# EAGLE design SuperPET OS9 MMU v2.9 (EAGLE 7.7.0)
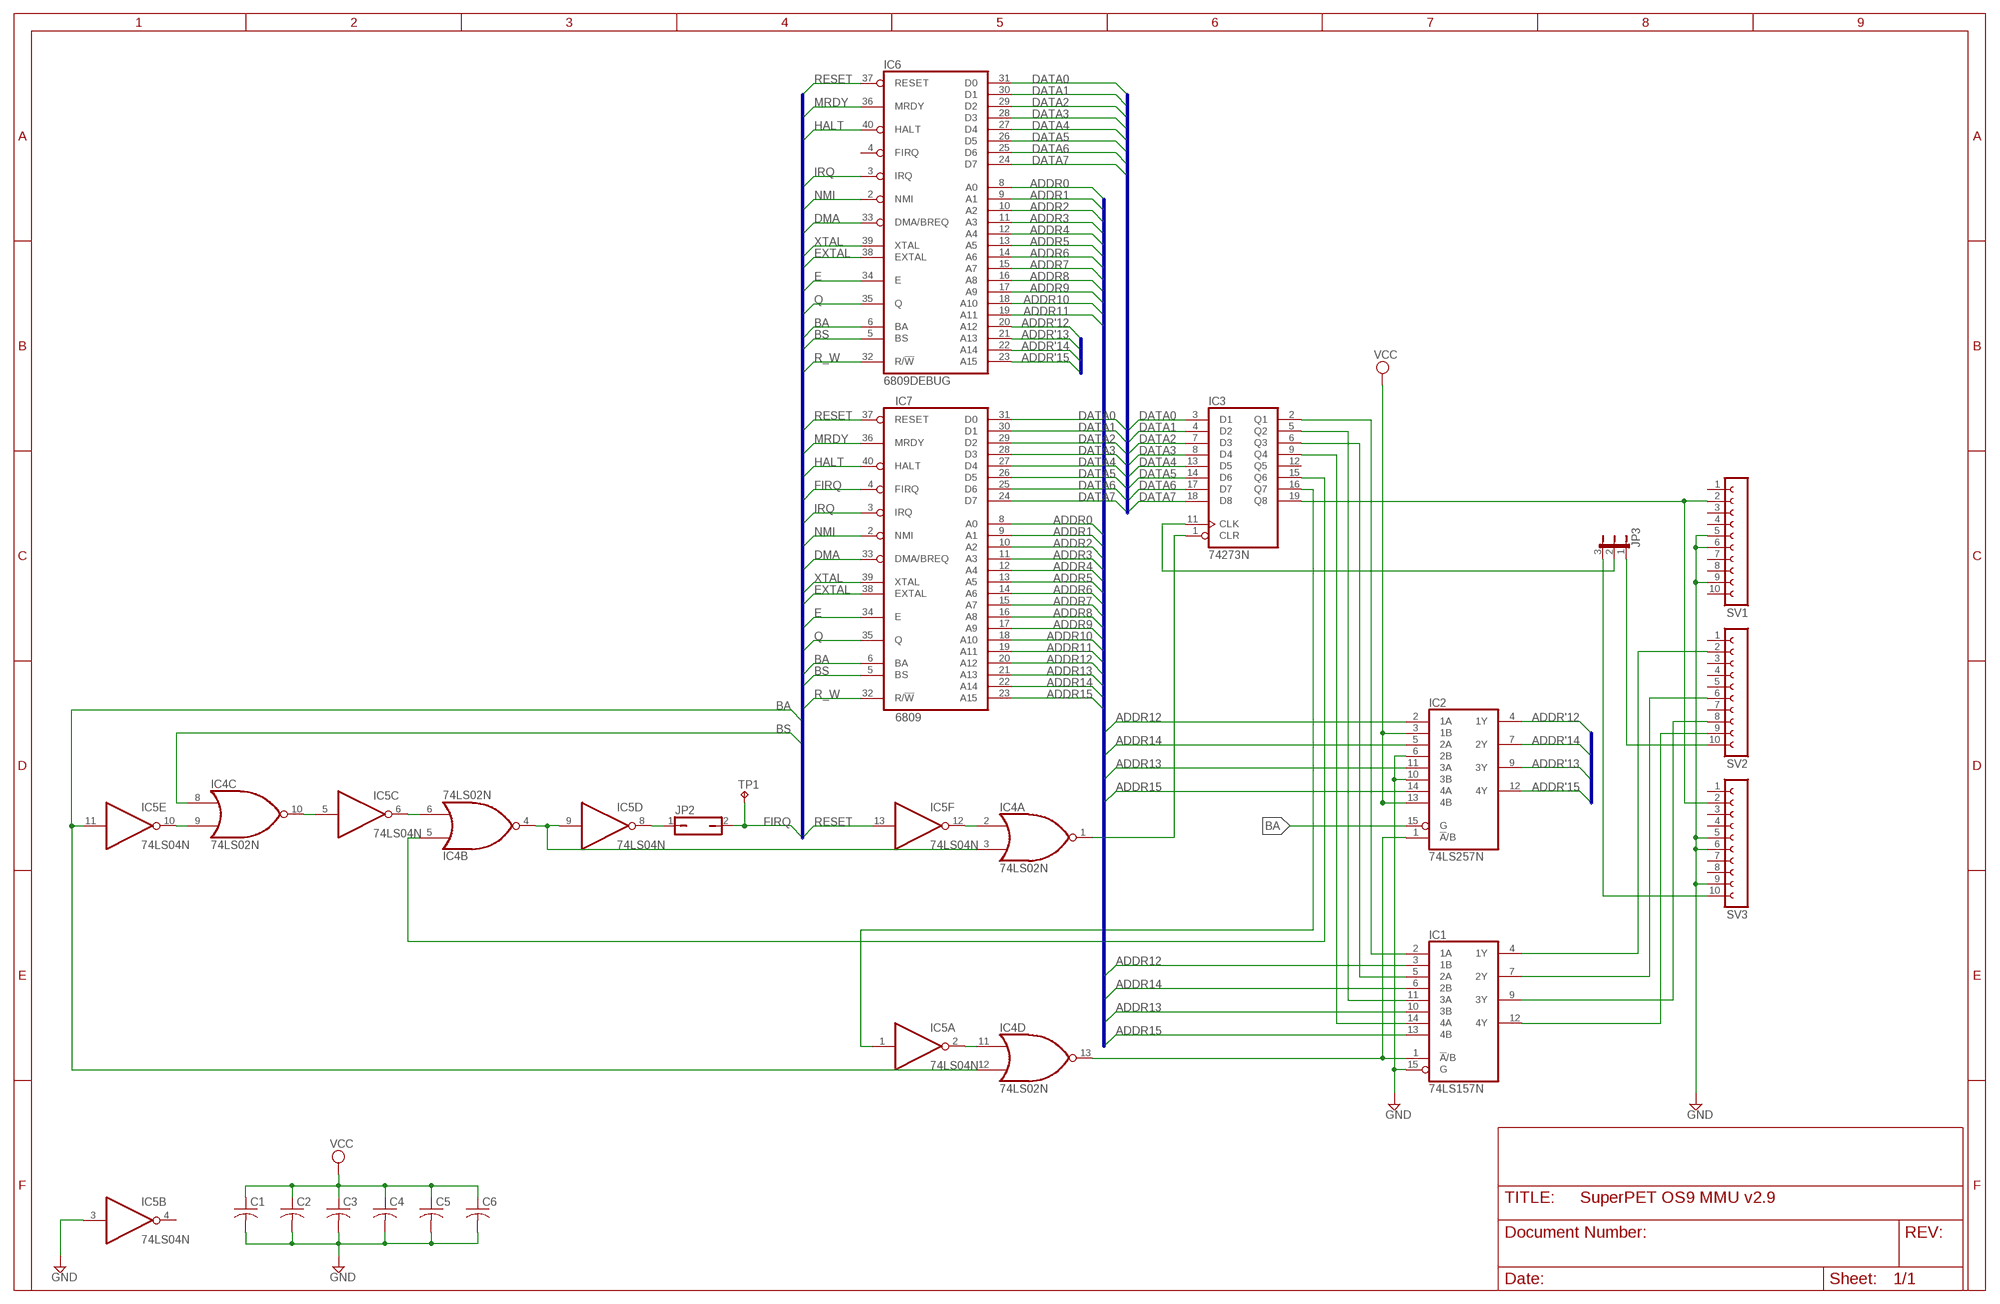
[diagram p0: schematic, sheet 1]

## Parts
C1  C-US025-025X050  [C025-025X050]
C2  C-US025-025X050  [C025-025X050]
C3  C-US025-025X050  [C025-025X050]
C4  C-US025-025X050  [C025-025X050]
C5  C-US025-025X050  [C025-025X050]
C6  C-US025-025X050  [C025-025X050]
IC1  74LS157N  [DIL16]
IC2  74LS257N  [DIL16]
IC3  74273N  [DIL20]
IC4  74LS02N  [DIL14]
IC5  74LS04N  [DIL14]
IC6  6809DEBUG  [DIL40]
IC7  6809  [DIL40]
JP2  JP1Q  [JP1]
JP3  JP2E  [JP2]
SV1  FE10-1  [FE10]
SV2  FE10-1  [FE10]
SV3  FE10-1  [FE10]
TP1  TPPAD1-17  [P1-17]

## Nets
ADDR0: IC6.8(A0) IC7.8(A0)
ADDR1: IC6.9(A1) IC7.9(A1)
ADDR2: IC6.10(A2) IC7.10(A2)
ADDR3: IC6.11(A3) IC7.11(A3)
ADDR4: IC6.12(A4) IC7.12(A4)
ADDR5: IC6.13(A5) IC7.13(A5)
ADDR6: IC6.14(A6) IC7.14(A6)
ADDR7: IC6.15(A7) IC7.15(A7)
ADDR8: IC6.16(A8) IC7.16(A8)
ADDR9: IC6.17(A9) IC7.17(A9)
ADDR10: IC6.18(A10) IC7.18(A10)
ADDR11: IC6.19(A11) IC7.19(A11)
ADDR12: IC1.3(1B) IC2.2(1A) IC7.20(A12)
ADDR13: IC1.10(3B) IC2.11(3A) IC7.21(A13)
ADDR14: IC1.6(2B) IC2.5(2A) IC7.22(A14)
ADDR15: IC1.13(4B) IC2.14(4A) IC7.23(A15)
ADDR'12: IC2.4(1Y) IC6.20(A12)
ADDR'13: IC2.9(3Y) IC6.21(A13)
ADDR'14: IC2.7(2Y) IC6.22(A14)
ADDR'15: IC2.12(4Y) IC6.23(A15)
BA: IC2.15(G) IC4.12(D:I1) IC5.11(E:I) IC6.6(BA) IC7.6(BA)
BS: IC4.8(C:I0) IC6.5(BS) IC7.5(BS)
DATA0: IC3.3(D1) IC6.31(D0) IC7.31(D0)
DATA1: IC3.4(D2) IC6.30(D1) IC7.30(D1)
DATA2: IC3.7(D3) IC6.29(D2) IC7.29(D2)
DATA3: IC3.8(D4) IC6.28(D3) IC7.28(D3)
DATA4: IC3.13(D5) IC6.27(D4) IC7.27(D4)
DATA5: IC3.14(D6) IC6.26(D5) IC7.26(D5)
DATA6: IC3.17(D7) IC6.25(D6) IC7.25(D6)
DATA7: IC3.18(D8) IC6.24(D7) IC7.24(D7)
DMA: IC6.33(DMA/BREQ) IC7.33(DMA/BREQ)
E: IC6.34(E) IC7.34(E)
EXTAL: IC6.38(EXTAL) IC7.38(EXTAL)
FIRQ: IC7.4(FIRQ) JP2.2 TP1.1(TP)
GND: C1.2 C2.2 C3.2 C4.2 C5.2 C6.2 IC1.15(G) IC2.6(2B) IC2.10(3B) IC5.3(B:I) SV1.5 SV1.6 SV1.9 SV3.5 SV3.6 SV3.9
HALT: IC6.40(HALT) IC7.40(HALT)
IRQ: IC6.3(IRQ) IC7.3(IRQ)
MRDY: IC6.36(MRDY) IC7.36(MRDY)
N$5: IC1.1(!A!/B) IC2.1(!A!/B) IC4.13(D:O)
N$6: IC3.1(CLR) IC4.1(A:O)
N$7: IC4.2(A:I0) IC5.12(F:O)
N$8: IC5.8(D:O) JP2.1
N$9: IC4.3(A:I1) IC4.4(B:O) IC5.9(D:I)
N$10: IC3.15(Q6) IC4.5(B:I0)
N$11: IC4.6(B:I1) IC5.6(C:O)
N$12: IC4.10(C:O) IC5.5(C:I)
N$13: IC4.9(C:I1) IC5.10(E:O)
N$14: IC4.11(D:I0) IC5.2(A:O)
N$15: IC3.16(Q7) IC5.1(A:I)
N$16: IC1.2(1A) IC3.2(Q1)
N$17: IC1.14(4A) IC3.9(Q4)
N$18: IC1.11(3A) IC3.5(Q2)
N$19: IC1.7(2Y) SV2.6
N$20: IC3.19(Q8) SV1.2 SV3.2
N$21: IC1.12(4Y) SV2.9
N$22: JP3.1 SV2.10
N$23: IC3.11(CLK) JP3.2
N$24: JP3.3 SV3.10
N$25: IC1.5(2A) IC3.6(Q3)
N$26: IC1.4(1Y) SV2.2
N$27: IC1.9(3Y) SV2.8
NMI: IC6.2(NMI) IC7.2(NMI)
Q: IC6.35(Q) IC7.35(Q)
R_W: IC6.32(R/!W) IC7.32(R/!W)
RESET: IC5.13(F:I) IC6.37(RESET) IC7.37(RESET)
VCC: C1.1 C2.1 C3.1 C4.1 C5.1 C6.1 IC2.3(1B) IC2.13(4B)
XTAL: IC6.39(XTAL) IC7.39(XTAL)
Unconnected: IC3.12(Q5) IC5.4(B:O) IC6.4(FIRQ) SV1.1 SV1.3 SV1.4 SV1.7 SV1.8 SV1.10 SV2.1 SV2.3 SV2.4 SV2.5 SV2.7 SV3.1 SV3.3 SV3.4 SV3.7 SV3.8

## Buses
RESET,MRDY,HALT,FIRQ,IRQ,NMI,DMA,XTAL,EXTAL,E,Q,BA,BS,R_W
ADDR[0..15]
DATA[0..7]
ADDR'[12..15]

## Power pins joined to a net without a drawn wire
GND: IC1.8(GND) IC2.8(GND) IC3.10(GND) IC4.7(P:GND) IC5.7(P:GND) IC6.1(GND) IC7.1(GND)
VCC: IC1.16(VCC) IC2.16(VCC) IC3.20(VCC) IC4.14(P:VCC) IC5.14(P:VCC) IC6.7(VCC) IC7.7(VCC)

## Library data of the parts
C1-C6 = rcl:C-US: CAPACITOR, American symbol
IC1 = 74xx-us:74*157: Quadruple 2-line to 1-line data SELECTOR/MULTIPLEXER
IC2 = 74xx-us:74*257: Quadruple 2-to 1 line data SELECTOR/MULTIPLEXER
IC3 = 74xx-us:74*273: Octal D type FLIP FLOP, clear
IC4 = 74xx-us:74*02: Quad 2-input NOR gate
IC5 = 74xx-us:74*04: Hex INVERTER
IC6 = 0RB_Motorola:6809DEBUG: 6809 counterpart to enable to replace the CPU with a PCB
IC7 = 0RB_Motorola:6809: 6809 processor
JP2 = jumper:JP1Q: JUMPER
JP3 = jumper:JP2E: JUMPER
SV1-SV3 = con-lsta:FE10-1: FEMALE HEADER
TP1 = testpad:TP: Test pad

## Board
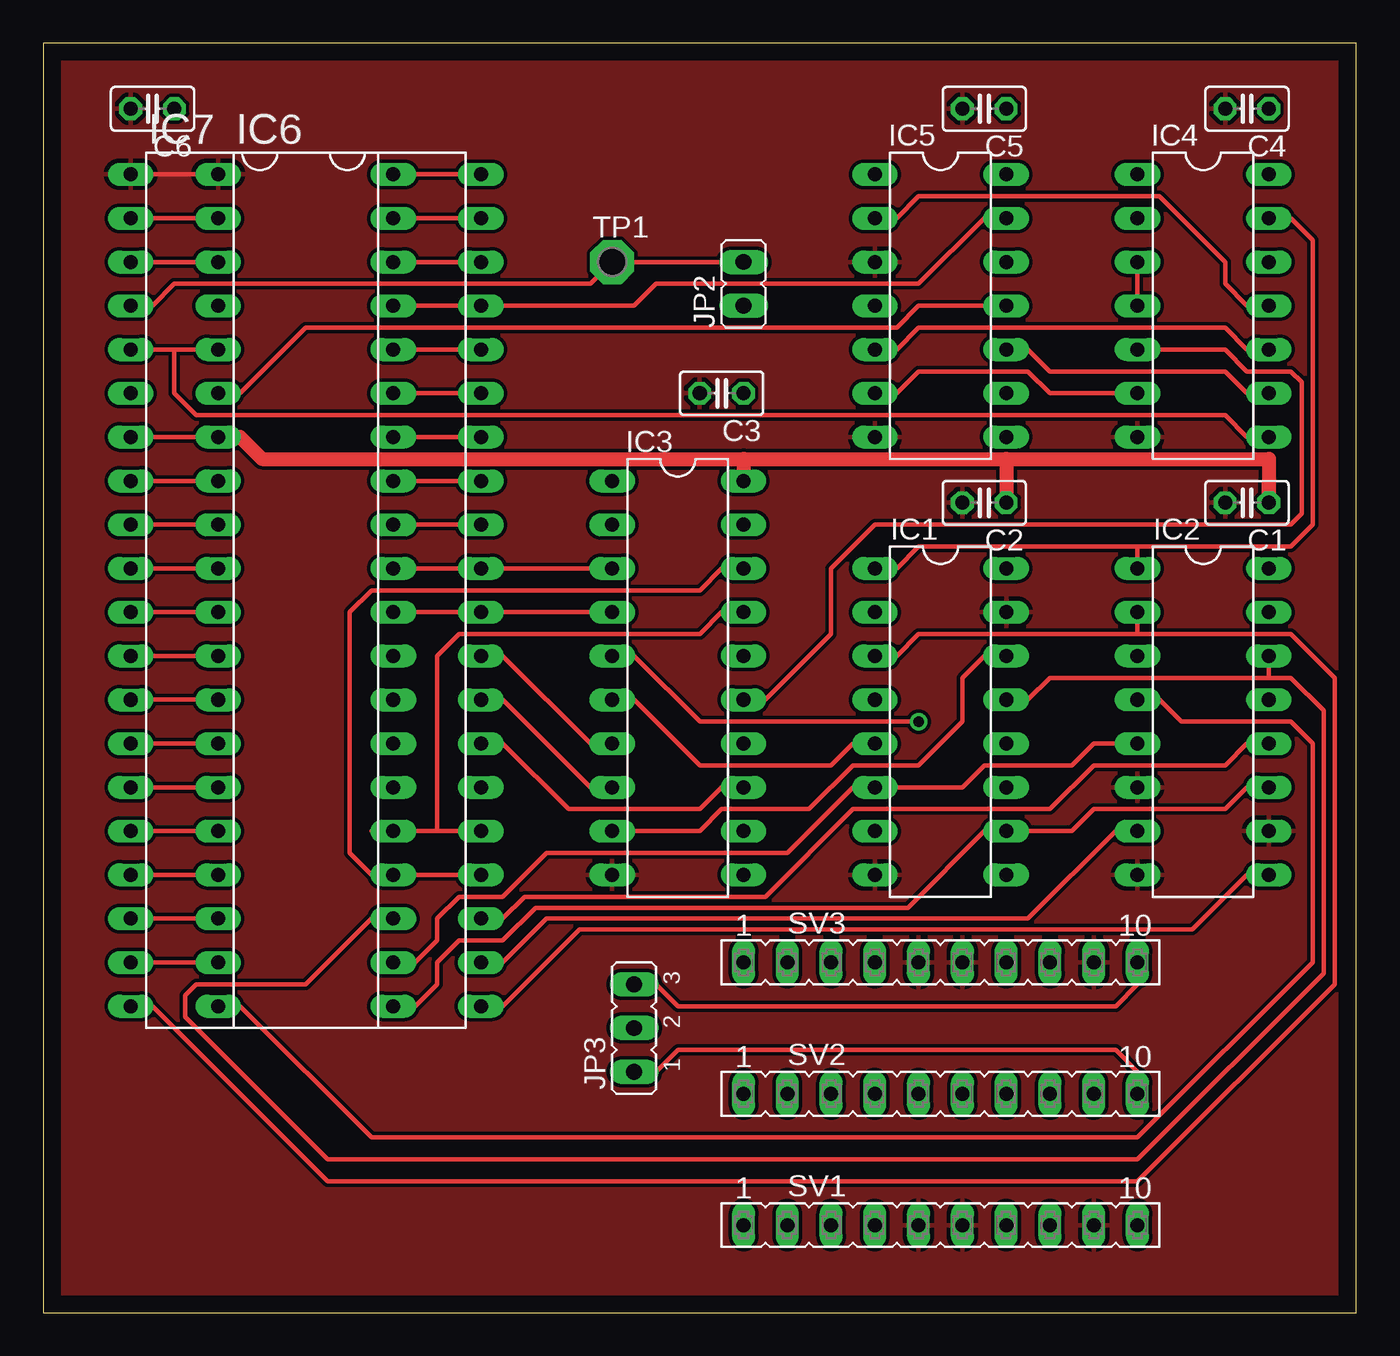
[diagram p1: board, top side]
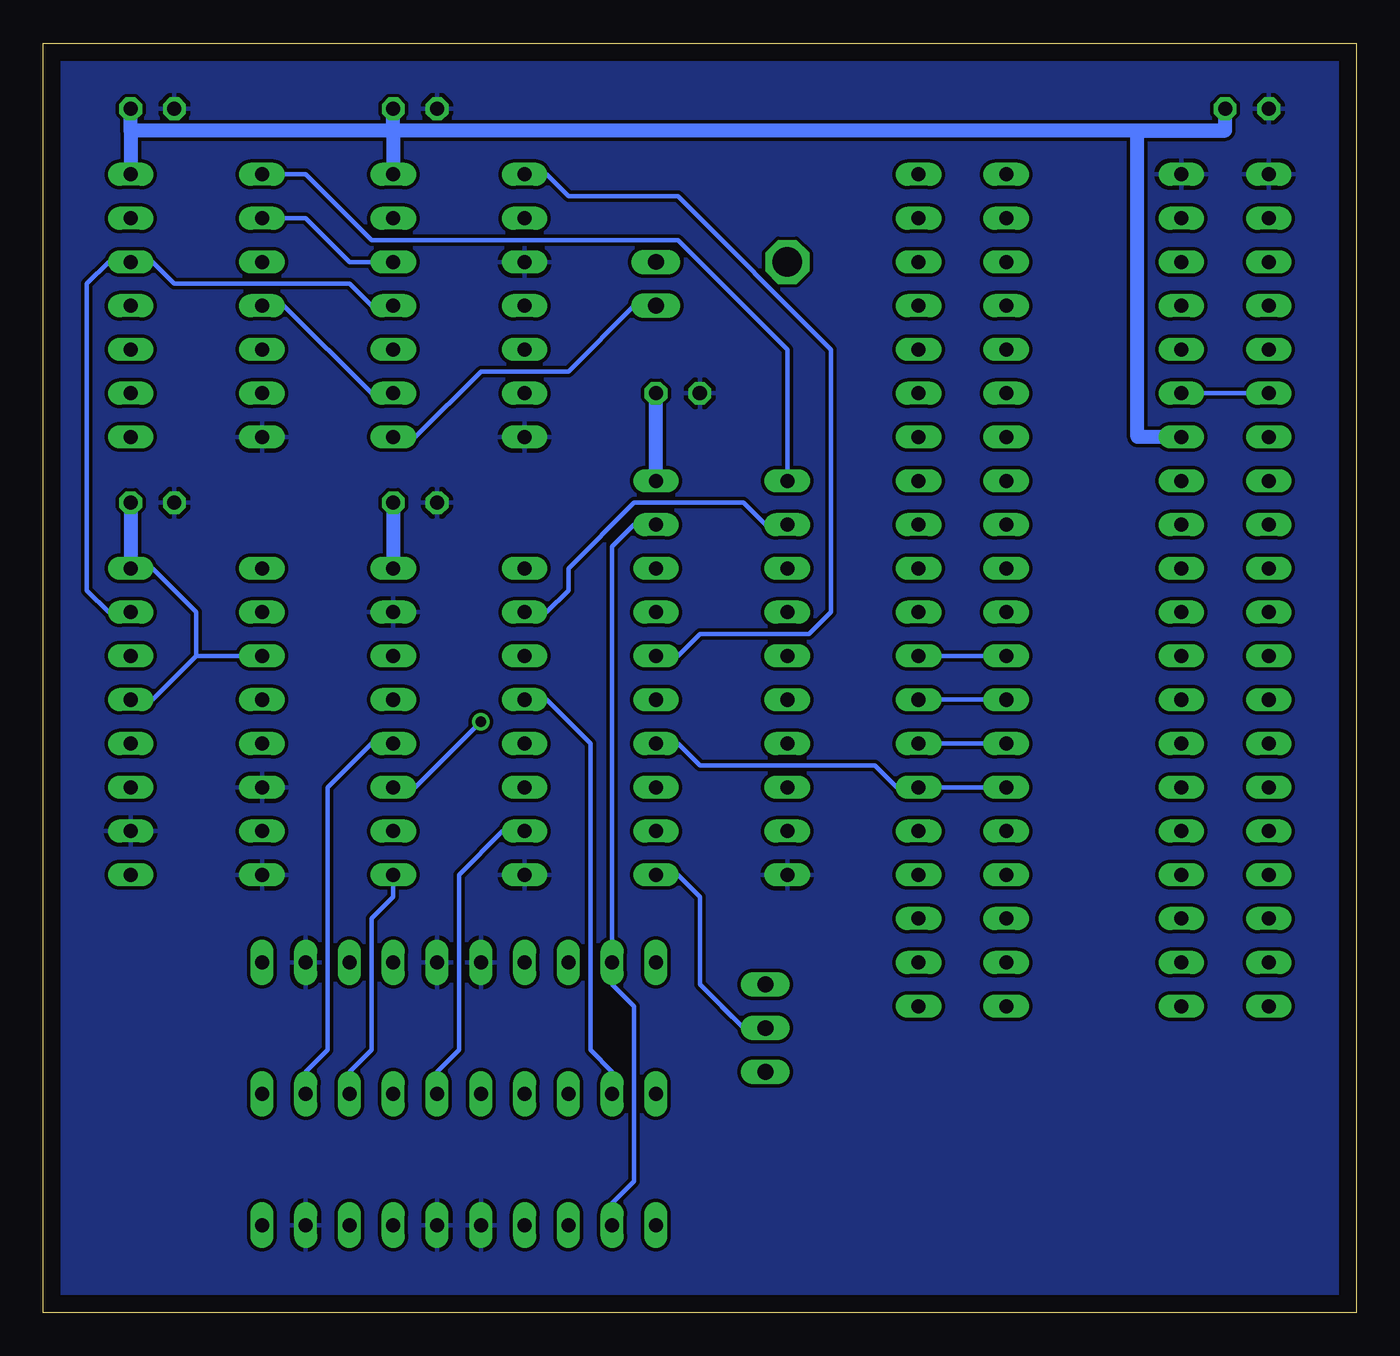
[diagram p2: board, bottom side, seen from below]

Size 76.2 x 73.66 mm. Coordinates in mm from the lower left corner, seen from the top.
Outline: 76.2,73.66 0,73.66 0,0 76.2,0 76.2,73.66
Copper layers (1*16): Top 0.035mm / dielectric 1.5mm / Bottom 0.035mm
Design rules "default": minimum track width 10mil, minimum drill 24mil, track to track 8mil, track to pad 8mil, pad to pad 8mil, via to via 8mil, smd to smd 8mil, copper to edge 40mil, drill to drill 8mil, minimum pad ring 10mil, minimum via ring 8mil, stop-mask expansion 4mil, vias tented up to drill 0mil, thermal gap 10mil

### Footprints (pad centres in the part's own frame; a part is rotated, then mirrored left to right if it is on the bottom)
C025-025X050 = drill 0.813 octagon: 1 -1.27,0; 2 1.27,0
DIL16 = drill 0.813 long: 1 -8.89,-3.81; 2 -6.35,-3.81; 3 -3.81,-3.81; 4 -1.27,-3.81; 5 1.27,-3.81; 6 3.81,-3.81; 7 6.35,-3.81; 8 8.89,-3.81; 9 8.89,3.81; 10 6.35,3.81; 11 3.81,3.81; 12 1.27,3.81; 13 -1.27,3.81; 14 -3.81,3.81; 15 -6.35,3.81; 16 -8.89,3.81
DIL20 = drill 0.813 long: 1 -11.43,-3.81; 2 -8.89,-3.81; 3 -6.35,-3.81; 4 -3.81,-3.81; 5 -1.27,-3.81; 6 1.27,-3.81; 7 3.81,-3.81; 8 6.35,-3.81; 9 8.89,-3.81; 10 11.43,-3.81; 11 11.43,3.81; 12 8.89,3.81; 13 6.35,3.81; 14 3.81,3.81; 15 1.27,3.81; 16 -1.27,3.81; 17 -3.81,3.81; 18 -6.35,3.81; 19 -8.89,3.81; 20 -11.43,3.81
DIL14 = drill 0.813 long: 1 -7.62,-3.81; 2 -5.08,-3.81; 3 -2.54,-3.81; 4 0,-3.81; 5 2.54,-3.81; 6 5.08,-3.81; 7 7.62,-3.81; 8 7.62,3.81; 9 5.08,3.81; 10 2.54,3.81; 11 0,3.81; 12 -2.54,3.81; 13 -5.08,3.81; 14 -7.62,3.81
DIL40 = drill 0.813 long: 1 -24.13,-7.62; 2 -21.59,-7.62; 3 -19.05,-7.62; 4 -16.51,-7.62; 5 -13.97,-7.62; 6 -11.43,-7.62; 7 -8.89,-7.62; 8 -6.35,-7.62; 9 -3.81,-7.62; 10 -1.27,-7.62; 11 1.27,-7.62; 12 3.81,-7.62; 13 6.35,-7.62; 14 8.89,-7.62; 15 11.43,-7.62; 16 13.97,-7.62; 17 16.51,-7.62; 18 19.05,-7.62; 19 21.59,-7.62; 20 24.13,-7.62; 21 24.13,7.62; 22 21.59,7.62; 23 19.05,7.62; 24 16.51,7.62; 25 13.97,7.62; 26 11.43,7.62; 27 8.89,7.62; 28 6.35,7.62; 29 3.81,7.62; 30 1.27,7.62; 31 -1.27,7.62; 32 -3.81,7.62; 33 -6.35,7.62; 34 -8.89,7.62; 35 -11.43,7.62; 36 -13.97,7.62; 37 -16.51,7.62; 38 -19.05,7.62; 39 -21.59,7.62; 40 -24.13,7.62
JP1 = drill 0.914 long: 1 0,-1.27; 2 0,1.27
JP2 = drill 0.914 long: 1 -2.54,0; 2 0,0; 3 2.54,0
FE10 = drill 0.813 long: 1 -11.43,0; 2 -8.89,0; 3 -6.35,0; 4 -3.81,0; 5 -1.27,0; 6 1.27,0; 7 3.81,0; 8 6.35,0; 9 8.89,0; 10 11.43,0
P1-17 = drill 1.702 pad 2.54 octagon: 1 0,0

### Placement (x,y rotation side)
C1  69.85,46.99 180 top
C2  54.61,46.99 180 top
C3  39.37,53.34 180 top
C4  69.85,69.85 180 top
C5  54.61,69.85 180 top
C6  6.35,69.85 180 top
IC1  52.07,34.29 270 top
IC2  67.31,34.29 270 top
IC3  36.83,36.83 270 top
IC4  67.31,58.42 270 top
IC5  52.07,58.42 270 top
IC6  17.78,41.91 270 top
IC7  12.7,41.91 270 top
JP2  40.64,59.69 0 top
JP3  34.29,16.51 90 top
SV1  52.07,5.08 0 top
SV2  52.07,12.7 0 top
SV3  52.07,20.32 0 top
TP1  33.02,60.96 0 top

### Tracks (layer width: path | path; a pad name or v marks a point on that pad's centre or on a via)
ADDR0
  Top 0.254: IC7.8 IC6.8
ADDR1
  Top 0.254: IC7.9 IC6.9
ADDR2
  Top 0.254: IC7.10 IC6.10
ADDR3
  Top 0.254: IC7.11 IC6.11
ADDR4
  Top 0.254: IC7.12 IC6.12
ADDR5
  Top 0.254: IC7.13 IC6.13
ADDR6
  Top 0.254: IC7.14 IC6.14
ADDR7
  Top 0.254: IC7.15 IC6.15
ADDR8
  Top 0.254: IC7.16 IC6.16
ADDR9
  Top 0.254: IC7.17 IC6.17
ADDR10
  Top 0.254: IC7.18 IC6.18
ADDR11
  Top 0.254: IC7.19 IC6.19
ADDR12
  Top 0.254: IC1.3 49.53,38.1 50.8,39.37 63.5,39.37 | IC7.20 6.35,17.78 16.51,7.62 63.5,7.62 74.93,19.05 74.93,36.83 72.39,39.37 63.5,39.37 | 63.5,39.37 IC2.2
ADDR13
  Top 0.254: IC2.11 69.85,30.48 68.58,29.21 60.96,29.21 59.69,27.94 IC1.10 54.61,27.94 50.16,23.5 28.57,23.5 26.67,21.59 24.13,21.59 22.86,20.32 22.86,19.05 21.59,17.78 IC7.21
ADDR14
  Top 0.254: IC2.5 60.96,33.02 59.69,31.75 54.61,31.75 53.34,30.48 IC1.6 46.99,30.48 43.18,26.67 29.21,26.67 26.67,24.13 24.13,24.13 22.86,22.86 22.86,21.59 21.59,20.32 IC7.22
ADDR15
  Top 0.254: 71.12,36.83 58.42,36.83 57.15,35.56 IC1.13 | IC7.23 19.05,22.86 15.24,19.05 8.89,19.05 8.26,18.41 8.26,17.14 16.51,8.89 63.5,8.89 74.3,19.68 74.3,34.92 72.39,36.83 71.12,36.83 | 71.12,36.83 IC2.14
ADDR'12
  Top 0.254: IC6.20 11.43,17.78 19.05,10.16 63.5,10.16 73.66,20.32 73.66,33.02 72.39,34.29 66.04,34.29 64.77,35.56 IC2.4
ADDR'13
  Top 0.254: IC6.21 26.67,17.78 31.11,22.23 66.67,22.23 69.85,25.4 IC2.9
ADDR'14
  Top 0.254: IC6.22 26.67,20.32 29.21,22.86 57.15,22.86 62.23,27.94 IC2.7
ADDR'15
  Top 0.254: IC6.23 26.67,22.86 27.94,24.13 41.91,24.13 46.99,29.21 58.42,29.21 60.96,31.75 68.58,31.75 69.85,33.02 IC2.12
BA
  Top 0.254: IC6.6 11.43,53.34 15.24,57.15 49.53,57.15 50.8,58.42 IC5.11
  Bottom 0.254: IC7.6 IC6.6 | IC5.11 57.15,58.42 58.42,59.69 68.58,59.69 69.85,60.96 IC4.12 72.39,60.96 73.66,59.69 73.66,41.91 72.39,40.64 IC2.15
BS
  Top 0.254: 7.62,55.88 IC6.5 | IC4.8 69.85,50.8 68.58,52.07 8.89,52.07 7.62,53.34 7.62,55.88 | 7.62,55.88 IC7.5
DATA0
  Top 0.254: IC7.31 IC6.31 IC3.3
DATA1
  Top 0.254: IC7.30 IC6.30 IC3.4
DATA2
  Top 0.254: IC6.29 26.67,38.1 31.75,33.02 IC3.7
  Bottom 0.254: IC7.29 IC6.29
DATA3
  Top 0.254: IC6.28 26.67,35.56 31.75,30.48 IC3.8
  Bottom 0.254: IC7.28 IC6.28
DATA4
  Top 0.254: IC6.27 26.67,33.02 30.48,29.21 38.1,29.21 39.37,30.48 IC3.13
  Bottom 0.254: IC7.27 IC6.27
DATA5
  Bottom 0.254: IC7.26 IC6.26 26.67,30.48 27.94,31.75 38.1,31.75 39.37,33.02 IC3.14
DATA6
  Top 0.254: 22.86,27.94 IC6.25 | IC3.17 39.37,40.64 38.1,39.37 24.13,39.37 22.86,38.1 22.86,27.94 | 22.86,27.94 IC7.25 19.05,27.94
DATA7
  Top 0.254: IC6.24 IC7.24 19.05,25.4 17.78,26.67 17.78,40.64 19.05,41.91 38.1,41.91 39.37,43.18 IC3.18
DMA
  Top 0.254: IC7.33 IC6.33
E
  Top 0.254: IC7.34 IC6.34
EXTAL
  Top 0.254: IC7.38 IC6.38
FIRQ
  Top 0.254: IC7.4 6.35,58.42 7.62,59.69 31.75,59.69 TP1.1 JP2.2
GND
  Top 0.254: IC7.1 IC6.1
  pour Top: 0,73.66 76.2,73.66 76.2,0 0,0
  pour Bottom: 0,73.66 76.2,73.66 76.2,0 0,0
HALT
  Top 0.254: IC7.40 IC6.40
IRQ
  Top 0.254: IC7.3 IC6.3
MRDY
  Top 0.254: IC7.36 IC6.36
N$5
  Top 0.254: IC1.1 49.53,43.18 50.8,44.45 63.5,44.45 | IC4.13 72.39,63.5 73.66,62.23 73.66,45.72 72.39,44.45 63.5,44.45 | 63.5,44.45 IC2.1
N$6
  Bottom 0.254: IC4.1 60.96,66.04 57.15,62.23 39.37,62.23 33.02,55.88 IC3.1
N$7
  Bottom 0.254: IC5.12 58.42,60.96 60.96,63.5 IC4.2
N$8
  Bottom 0.254: JP2.1 41.91,58.42 45.72,54.61 50.8,54.61 54.61,50.8 IC5.8
N$9
  Top 0.254: IC4.4 IC4.3
  Bottom 0.254: IC5.9 57.15,53.34 62.23,58.42 IC4.4
N$10
  Top 0.254: IC3.15 41.91,35.56 45.72,39.37 45.72,43.18 48.26,45.72 72.39,45.72 73.03,46.35 73.03,53.98 72.39,54.61 69.85,54.61 68.58,55.88 IC4.5
N$11
  Top 0.254: IC5.6 49.53,53.34 50.8,54.61 57.15,54.61 58.42,53.34 IC4.6
N$12
  Top 0.254: IC5.5 49.53,55.88 50.8,57.15 68.58,57.15 69.85,55.88 IC4.10
N$13
  Top 0.254: IC5.10 57.15,55.88 58.42,54.61 68.58,54.61 69.85,53.34 IC4.9
N$14
  Top 0.254: IC5.2 49.53,63.5 50.8,64.77 64.77,64.77 68.58,60.96 68.58,59.69 69.85,58.42 IC4.11
N$15
  Bottom 0.254: IC5.1 46.99,66.04 45.72,64.77 39.37,64.77 30.48,55.88 30.48,40.64 31.75,39.37 38.1,39.37 39.37,38.1 IC3.16
N$16
  Bottom 0.254: IC3.2 34.29,45.72 35.56,46.99 41.91,46.99 45.72,43.18 45.72,41.91 46.99,40.64 IC1.2
N$17
  Top 0.254: IC3.9 38.1,27.94 39.37,29.21 44.45,29.21 46.99,31.75 50.8,31.75 53.34,34.29 53.34,36.83 54.61,38.1 IC1.14
N$18  (via drill 0.61)
  Top 0.254: IC3.5 34.29,38.1 38.1,34.29 v50.8,34.29
  Bottom 0.254: v50.8,34.29 54.61,30.48 IC1.11
N$19
  Bottom 0.254: SV2.6 53.34,13.97 52.07,15.24 52.07,25.4 49.53,27.94 IC1.7
N$20
  Bottom 0.254: SV1.2 43.18,6.35 41.91,7.62 41.91,17.78 43.18,19.05 SV3.2 43.18,44.45 41.91,45.72 IC3.19
N$21
  Bottom 0.254: SV2.9 60.96,13.97 59.69,15.24 59.69,30.48 57.15,33.02 IC1.12
N$22
  Top 0.254: SV2.10 63.5,13.97 62.23,15.24 36.83,15.24 35.56,13.97 JP3.1
N$23
  Bottom 0.254: IC3.11 39.37,25.4 38.1,24.13 38.1,19.05 35.56,16.51 | 35.56,16.51 36.83,17.78 | JP3.2 35.56,16.51
N$24
  Top 0.254: SV3.10 63.5,19.05 62.23,17.78 36.83,17.78 35.56,19.05 JP3.3
N$25
  Top 0.254: IC3.6 34.29,35.56 38.1,31.75 45.72,31.75 46.99,33.02 IC1.5
N$26
  Bottom 0.254: IC1.4 46.99,35.56 44.45,33.02 44.45,15.24 43.18,13.97 SV2.2
N$27
  Bottom 0.254: SV2.8 58.42,13.97 57.15,15.24 57.15,22.86 55.88,24.13 IC1.9
NMI
  Top 0.254: IC7.2 IC6.2
Q
  Top 0.254: IC7.35 IC6.35
R_W
  Top 0.254: IC7.32 IC6.32
RESET
  Top 0.254: IC7.37 IC6.37 34.29,58.42 35.56,59.69 50.8,59.69 54.61,63.5 IC5.13
VCC
  Top 0.254: IC7.7 IC6.7
  Top 0.813: 71.12,48.26 C1.1 71.12,49.53 55.88,49.53 | IC6.7 11.43,50.8 12.7,49.53 40.64,49.53 | 40.64,49.53 55.88,49.53 | 40.64,49.53 IC3.20 | 55.88,49.53 C2.1
  Bottom 0.254: 67.31,38.1 IC2.3 | 67.31,38.1 69.85,35.56 IC2.13 | 67.31,38.1 67.31,40.64 69.85,43.18 IC2.16
  Bottom 0.813: 7.62,68.58 55.88,68.58 | 55.88,68.58 C5.1 | 55.88,68.58 IC5.14 | 71.12,68.58 IC4.14 | 55.88,68.58 71.12,68.58 | 71.12,68.58 C4.1 | IC6.7 12.7,50.8 12.7,68.58 7.62,68.58 | 7.62,68.58 C6.1 | IC3.20 C3.1 | C1.1 IC2.16 | C2.1 IC1.16
XTAL
  Top 0.254: IC7.39 IC6.39